# EasyEDA schematic LED blinking.json
TITLE: Sheet_1; REV: 1.0; Date: 2020-08-09; Sheet: 1/1; Company: Your Company
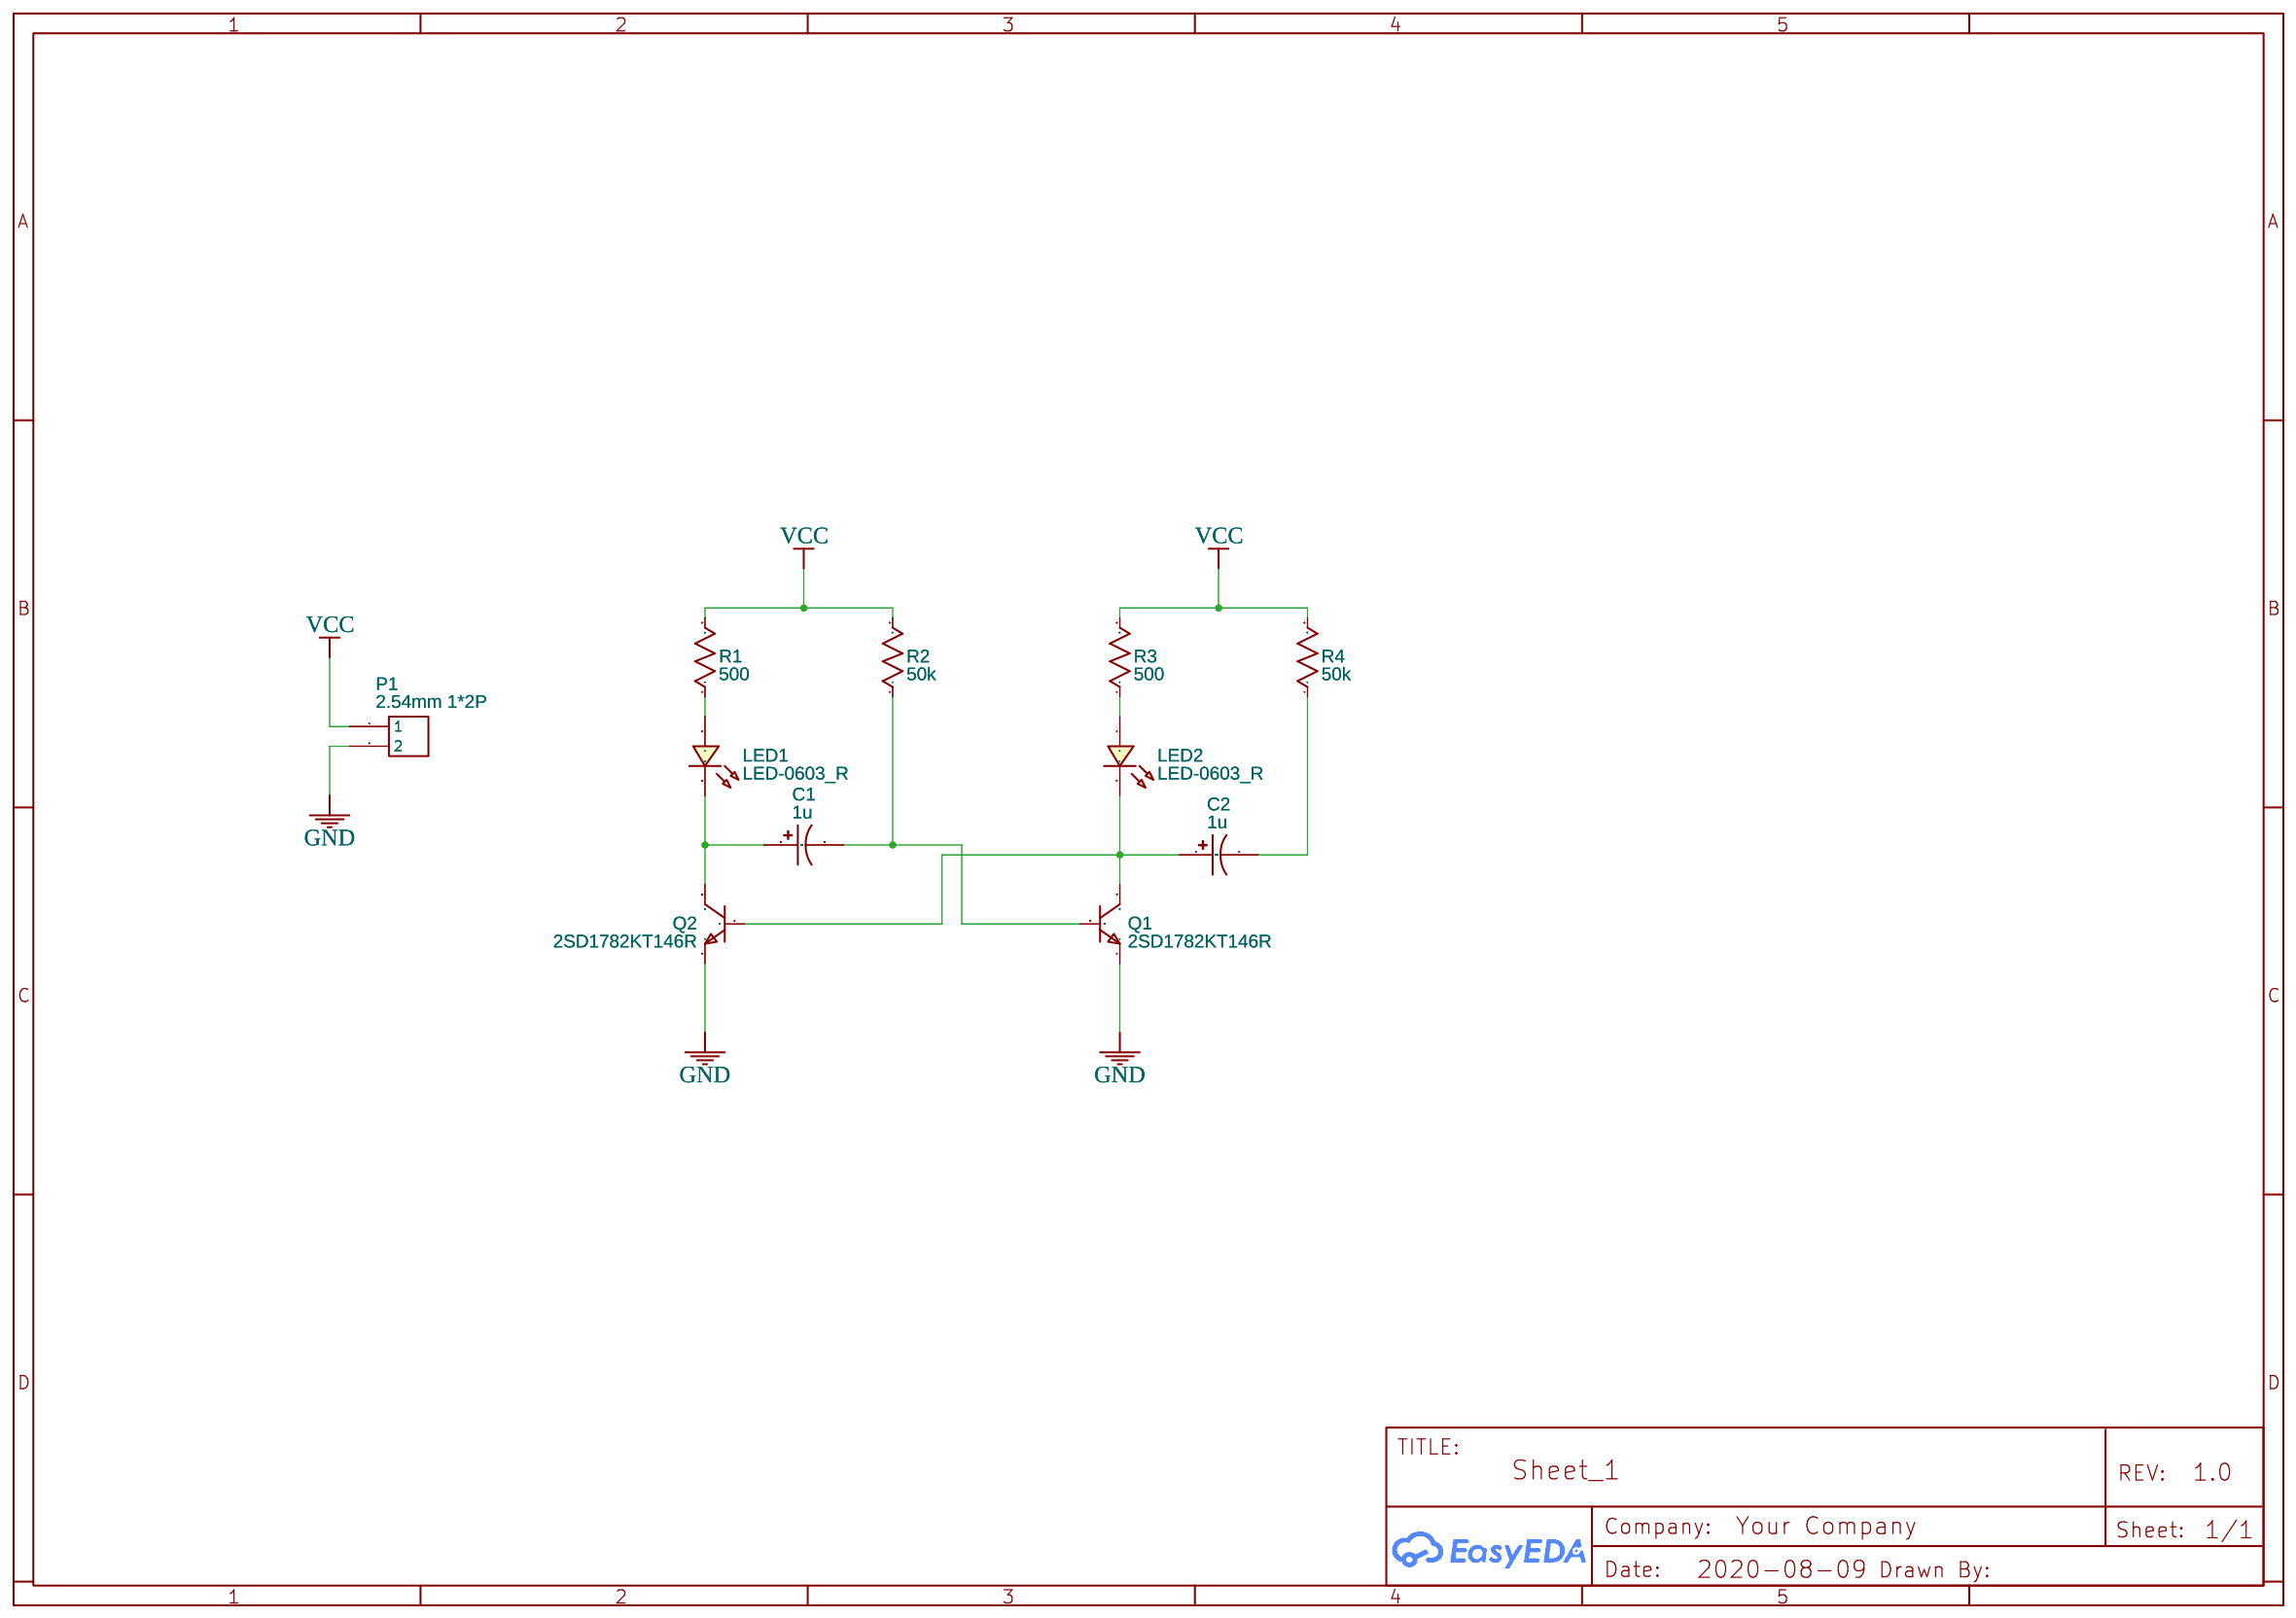
[diagram p0: schematic sheet]

## Parts
C1  1u  [CASE-A_3216]
C2  1u  [CASE-A_3216]
LED1  LED-0603_R  [LED0603_RED]
LED2  LED-0603_R  [LED0603_RED]
P1  2.54mm 1*2P  [HDR-TH_2P-P2.54-V-M]
Q1  2SD1782KT146R  [SOT-346_L2.9-W1.5-P1.90-LS2.5-TR-CW]
Q2  2SD1782KT146R  [SOT-346_L2.9-W1.5-P1.90-LS2.5-TR-CW]
R1  500  [R0603]
R2  50k  [R0603]
R3  500  [R0603]
R4  50k  [R0603]

## Library data of the parts
C1 C2 = C_Tan_SMD_A_US: Contributor: LCEDA_Lib
LED1 LED2 = LED-0603_R: Manufacturer: EVERLIGHT(台湾亿光); Manufacturer Part: 19-217/R6C-AL1M2VY/3T; Supplier Part: C72044; Supplier: LCSC; Contributor: LCEDA_01
P1 = 2.54mm 1*2P: Supplier: LCSC; Manufacturer: ReliaPro; image: http://image.lceda.cn/szlcsc/C36717.jpg; Supplier Part: C36717
Q1 Q2 = 2SD1782KT146R: Supplier: LCSC; Supplier Part: C86593; Manufacturer: ROHM Semicon; Contributor: LCSC; LCSC Assembly: Yes; SMT Type: Extend
R1-R4 = R_0603_US: Contributor: LCEDA_Lib

## Nets
GND: P1.2 Q1.1(E) Q2.1(E)
VCC: P1.1 R1.2 R2.2 R3.2 R4.2
Net-(C1-1): C1.1 LED1.2 Q2.3(C)
Net-(C1-2): C1.2 Q1.2(B) R2.1
Net-(C2-1): C2.1 LED2.2 Q1.3(C) Q2.2(B)
Net-(C2-2): C2.2 R4.1
Net-(LED1-1): LED1.1 R1.1
Net-(LED2-1): LED2.1 R3.1
